# Altium project esp32-s3.PrjPcb
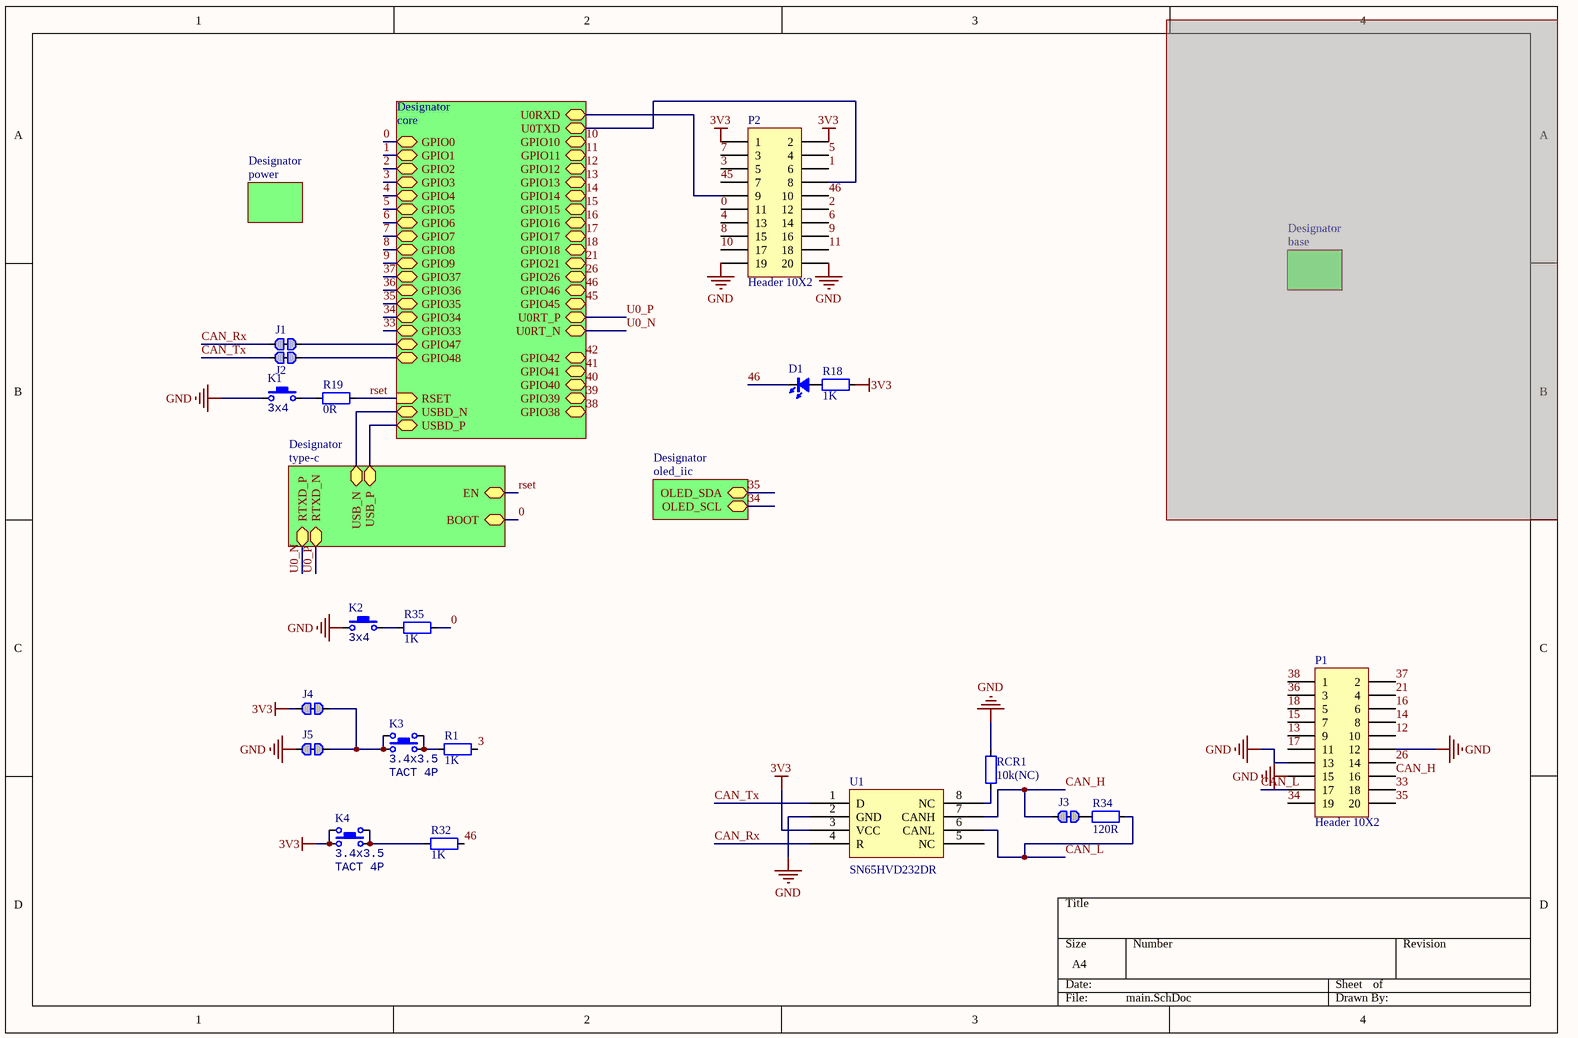
[diagram p0: main.SchDoc]
5 sheets, 70 parts. Net scope: hierarchical (ports join the sheet entries above them; power ports are global).
Board files: esp32-s3.PcbDoc, power.PcbDoc, port.PcbDoc, PCB1.PcbDoc
Sheets:
  main.SchDoc
    Designator = core.SchDoc
    Designator = type-c.SchDoc
    Designator = power.SchDoc

## Sheet main.SchDoc
size A4; SheetNumber: 1; SheetTotal: 6

### Parts
D1  color?  [LED_0402_RED]  (value not drawn)
J1  跳线  [0402-0R]  (value not drawn)
J2  跳线  [0402-0R]  (value not drawn)
J3  跳线  [0402-0R]  (value not drawn)
J4  跳线  [0402-0R]  (value not drawn)
J5  跳线  [0402-0R]  (value not drawn)
K1  value 3x4  [ButtonTACT_3x4x2_180]  (hidden comment: TACT 2P)
K2  value 3x4  [ButtonTACT_3x4x2_180]  (hidden comment: TACT 2P)
K3  value 3.4x3.5  [ButtonTACT_3.5*3.55_90]  (hidden comment: TACT 4P)
K4  value 3.4x3.5  [ButtonTACT_3.5*3.55_90]  (hidden comment: TACT 4P)
P1  Header 10X2  [HEAER_0.8mm_2x10P_M]
P2  Header 10X2  [HEAER_0.8mm_2x10P_M]
R1  1K  [RES_0402]
R18  1K  [RES_0402]
R19  0R  [RES_0402]
R32  1K  [RES_0402]
R34  120R  [RES_0402]
R35  1K  [RES_0402]
RCR1  10k(NC)  [RES_0402]
U1  Manufacturer Part Number: SN65HVD232DR  [SO-8]  (hidden comment: SN65HVD232D)

### Sub-sheets
Designator = core: GPIO1 (bidir), GPIO2 (bidir), GPIO3 (bidir), GPIO4 (bidir), GPIO5 (bidir), GPIO6 (bidir), GPIO7 (bidir), GPIO8 (bidir), GPIO9 (bidir), GPIO37 (bidir), GPIO36 (bidir), GPIO35 (bidir), GPIO34 (bidir), GPIO47 (bidir), GPIO33 (bidir), GPIO48 (bidir), RSET (in), GPIO0 (bidir), GPIO10 (bidir), GPIO11 (bidir), GPIO12 (bidir), GPIO13 (bidir), GPIO14 (bidir), GPIO15 (bidir), GPIO17 (bidir), GPIO16 (bidir), GPIO18 (bidir), GPIO26 (bidir), GPIO21 (bidir), GPIO45 (bidir), U0RT_P (bidir), U0RT_N (bidir), GPIO42 (bidir), GPIO41 (bidir), GPIO40 (bidir), GPIO39 (bidir), GPIO38 (bidir), GPIO46 (bidir), USBD_N (bidir), USBD_P (bidir), U0TXD (bidir), U0RXD (bidir)
Designator = type-c: USB_P (bidir), USB_N (bidir), RTXD_P (bidir), RTXD_N (bidir), EN (bidir), BOOT (bidir)
Designator = power: no entries
Designator = oled_iic (file not in this document): OLED_SDA (bidir), OLED_SCL (bidir)
Designator = base (masked out): no entries

### Nets
3V3: J4.1 K4.1 K4.3 P2.1 P2.2 R18.1 U1.3(VCC)
GND: J5.1 K1.1 K2.1 P1.12 P1.13 P1.15 P2.19 P2.20 RCR1.2 U1.2(GND)
0: P2.11 R35.2 ; sheet Designator/GPIO0, sheet Designator/BOOT
1: P2.6 ; sheet Designator/GPIO1
2: P2.12 ; sheet Designator/GPIO2
3: P2.5 R1.2 ; sheet Designator/GPIO3
4: P2.13 ; sheet Designator/GPIO4
5: P2.4 ; sheet Designator/GPIO5
6: P2.14 ; sheet Designator/GPIO6
7: P2.3 ; sheet Designator/GPIO7
8: P2.15 ; sheet Designator/GPIO8
9: P2.16 ; sheet Designator/GPIO9
10: P2.17 ; sheet Designator/GPIO10
11: P2.18 ; sheet Designator/GPIO11
12: P1.10 ; sheet Designator/GPIO12
13: P1.9 ; sheet Designator/GPIO13
14: P1.8 ; sheet Designator/GPIO14
15: P1.7 ; sheet Designator/GPIO15
16: P1.6 ; sheet Designator/GPIO16
17: P1.11 ; sheet Designator/GPIO17
18: P1.5 ; sheet Designator/GPIO18
21: P1.4 ; sheet Designator/GPIO21
26: P1.14 ; sheet Designator/GPIO26
33: P1.18 ; sheet Designator/GPIO33
34: P1.19 ; sheet Designator/GPIO34, sheet Designator/OLED_SCL
35: P1.20 ; sheet Designator/GPIO35, sheet Designator/OLED_SDA
36: P1.3 ; sheet Designator/GPIO36
37: P1.2 ; sheet Designator/GPIO37
38: P1.1 ; sheet Designator/GPIO38
45: P2.7 ; sheet Designator/GPIO45
46: D1.2(K) P2.10 R32.2 ; sheet Designator/GPIO46
CAN_H: J3.1 P1.16 U1.7(CANH)
CAN_L: P1.17 R34.2 U1.6(CANL)
CAN_Rx: J1.1 U1.4(R)
CAN_Tx: J2.1 U1.1(D)
GPIO47: J1.2 ; sheet Designator/GPIO47
GPIO48: J2.2 ; sheet Designator/GPIO48
rset: R19.2 ; sheet Designator/RSET, sheet Designator/EN  [project net CHIP_CPU]
U0_N: sheet Designator/U0RT_N, sheet Designator/RTXD_P  [project net RTXD_P]
U0_P: sheet Designator/U0RT_P, sheet Designator/RTXD_N  [project net RTXD_N]
U0RT_N: P2.8 ; sheet Designator/U0TXD
U0RT_P: P2.9 ; sheet Designator/U0RXD
USB_N: sheet Designator/USBD_N, sheet Designator/USB_N
USB_P: sheet Designator/USBD_P, sheet Designator/USB_P
NetD1_1: D1.1(A) R18.2
NetJ3_2: J3.2 R34.1
NetJ4_2: J4.2 J5.2 K3.1 K3.3
NetK1_2: K1.2 R19.1
NetK2_2: K2.2 R35.1
NetK3_2: K3.2 K3.4 R1.1
NetK4_2: K4.2 K4.4 R32.1
NetRCR1_1: RCR1.1 U1.8(NC)

Not connected (* = marked no-connect by the designer): U1 5(NC)

### Library data of the parts
D1 = LED_0402: LED; Type: 0402; Value: color?
J1-J5 = 跳线: Resistor; Published: 8-Jun-2000; LatestRevisionDate: 17-Jul-2002; LatestRevisionNote: Re-released for DXP Platform.; PackageReference: AXIAL-0.4; Publisher: Altium Limited; PackageDescription: Axial Device, Thru-Hole; 2 Leads; 0.4 in Pin Spacing
K1 K2 = ButtonTACT_3x4x2_180: Button; type: TACT 2P
K3 K4 = ButtonTACT: Button; type: TACT 4P
P1 P2 = Header 10X2: Header, 10-Pin, Dual row; LatestRevisionDate: 17-Jul-2002; LatestRevisionNote: Re-released for DXP Platform.; Publisher: Altium Limited
R1 R18 R19 R32 R34 R35 RCR1 = 电阻-0402: Resistor; Value: 22R
U1 = SN65HVD232D: Manufacturer: Texas Instruments; Protocol: CAN; Number of Drivers/Receivers: 1/1; Duplex: Half; Data Rate: 1Mbps; Voltage - Supply: 3 V ~ 3.6 V; Supplier 1: Digi-Key; Supplier Part Number 1: 296-26344-2-ND; RoHS: RoHS Compliant; Category: Integrated Circuits (ICs); Stock: 5000; Pricing 1: 2500=0.84375 (USD); Packaging: Tape & Reel (TR); Part Status: Active; Type: Transceiver; Operating Temperature: -40°C ~ 85°C; Mounting Type: Surface Mount; Package / Case: 8-SOIC (0.154", 3.90mm Width); Supplier Device Package: 8-SOIC; ComponentLink1URL: http://www.ti.com/lit/ds/symlink/sn65hvd230.pdf; ComponentLink1Description: http://www.ti.com/lit/ds/symlink/sn65hvd230.pdf; Supplier 2: Digi-Key; Supplier Part Number 2: 296-26344-1-ND; Pricing 2: 1=2.05, 10=1.842, 100=1.4809, 500=1.21668, 1000=1.00811 (USD)

## Sheet core.SchDoc
size A4; SheetNumber: 2; SheetTotal: 6
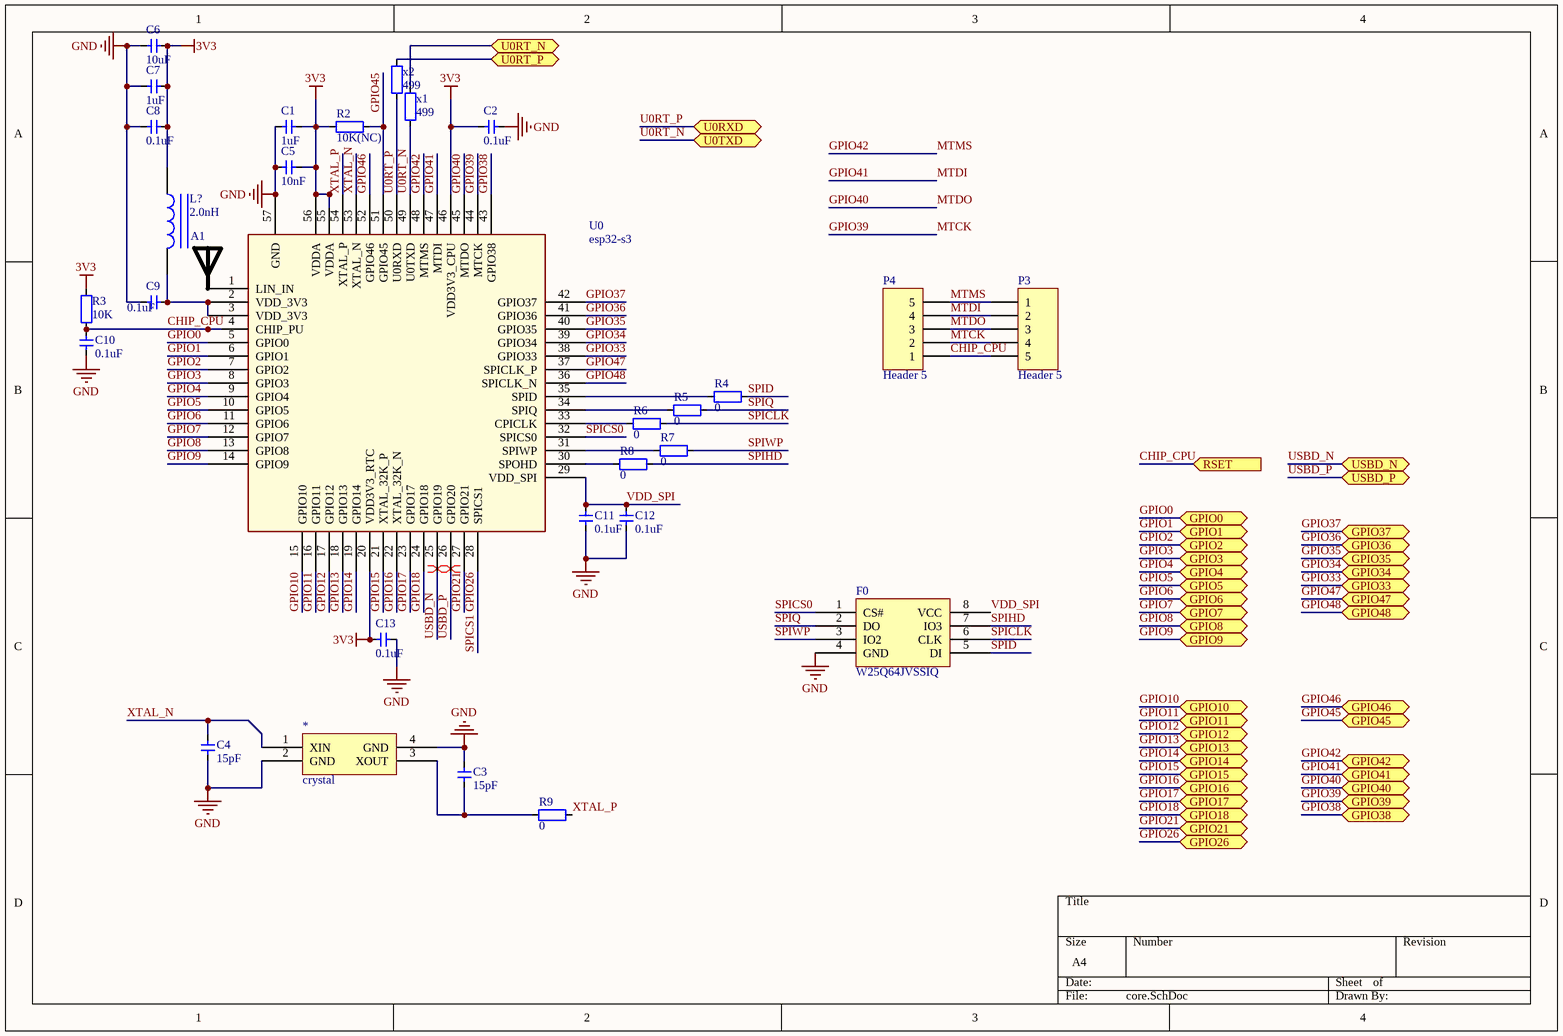
[diagram p1: core.SchDoc]

### Parts
*  crystal  [无源晶振]
A1  RAINSUN  [ANT-Rainsun-AN5120]  (value not drawn)
C1  1uF  [CAP_0402]
C2  0.1uF  [CAP_0402]
C3  15pF  [CAP_0402]
C4  15pF  [CAP_0402]
C5  10nF  [CAP_0402]
C6  10uF  [CAP_0402]
C7  1uF  [CAP_0402]
C8  0.1uF  [CAP_0402]
C9  0.1uF  [CAP_0402]
C10  0.1uF  [CAP_0402]
C11  0.1uF  [CAP_0402]
C12  0.1uF  [CAP_0402]
C13  0.1uF  [CAP_0402]
F0  W25Q64JVSSIQ  [W25Q64JVSSIQ]
L?  2.0nH  [LC-0402_L]
P3  Header 5  [HDR1X5]
P4  Header 5  [HDR1X5]
R2  10K(NC)  [RES_0402]
R3  10K  [RES_0402]
R4  0  [RES_0402]
R5  0  [RES_0402]
R6  0  [RES_0402]
R7  0  [RES_0402]
R8  0  [RES_0402]
R9  0  [RES_0402]
U0  esp32-s3  [esp32-s3]
x1  499  [RES_0402]
x2  499  [RES_0402]

### Ports
GPIO0 (bidir), GPIO1 (bidir), GPIO2 (bidir), GPIO3 (bidir), GPIO4 (bidir), GPIO5 (bidir), GPIO6 (bidir), GPIO7 (bidir), GPIO8 (bidir), GPIO9 (bidir), GPIO10 (bidir), GPIO11 (bidir), GPIO12 (bidir), GPIO13 (bidir), GPIO14 (bidir), GPIO15 (bidir), GPIO16 (bidir), GPIO17 (bidir), GPIO18 (bidir), GPIO21 (bidir), GPIO26 (bidir), GPIO33 (bidir), GPIO34 (bidir), GPIO35 (bidir), GPIO36 (bidir), GPIO37 (bidir), GPIO38 (bidir), GPIO39 (bidir), GPIO40 (bidir), GPIO41 (bidir), GPIO42 (bidir), GPIO45 (bidir), GPIO46 (bidir), GPIO47 (bidir), GPIO48 (bidir), RSET (in), U0RT_N (bidir), U0RT_P (bidir), U0RXD (bidir), U0TXD (bidir), USBD_N (bidir), USBD_P (bidir)

### Nets
3V3: C1.2 C2.2 C5.2 C6.2 C7.2 C8.2 C13.2 L?.1 R2.2 R3.1 U0.20(VDD3V3_RTC) U0.46(VDD3V3_CPU) U0.55(VDDA) U0.56(VDDA)
GND: *.2(GND) *.4(GND) C1.1 C2.1 C3.1 C4.1 C5.1 C6.1 C7.1 C8.1 C9.1 C10.2 C11.1 C12.1 C13.1 F0.4(GND) U0.57(GND)
CHIP_CPU: C10.1 P3.5 P4.1 R3.2 U0.4(CHIP_PU) ; port RSET
GPIO0: U0.5(GPIO0) ; port GPIO0  [project net 0]
GPIO1: U0.6(GPIO1) ; port GPIO1  [project net 1]
GPIO2: U0.7(GPIO2) ; port GPIO2  [project net 2]
GPIO3: U0.8(GPIO3) ; port GPIO3  [project net 3]
GPIO4: U0.9(GPIO4) ; port GPIO4  [project net 4]
GPIO5: U0.10(GPIO5) ; port GPIO5  [project net 5]
GPIO6: U0.11(GPIO6) ; port GPIO6  [project net 6]
GPIO7: U0.12(GPIO7) ; port GPIO7  [project net 7]
GPIO8: U0.13(GPIO8) ; port GPIO8  [project net 8]
GPIO9: U0.14(GPIO9) ; port GPIO9  [project net 9]
GPIO10: U0.15(GPIO10) ; port GPIO10  [project net 10]
GPIO11: U0.16(GPIO11) ; port GPIO11  [project net 11]
GPIO12: U0.17(GPIO12) ; port GPIO12  [project net 12]
GPIO13: U0.18(GPIO13) ; port GPIO13  [project net 13]
GPIO14: U0.19(GPIO14) ; port GPIO14  [project net 14]
GPIO15: U0.21(XTAL_32K_P) ; port GPIO15  [project net 15]
GPIO16: U0.22(XTAL_32K_N) ; port GPIO16  [project net 16]
GPIO17: U0.23(GPIO17) ; port GPIO17  [project net 17]
GPIO18: U0.24(GPIO18) ; port GPIO18  [project net 18]
GPIO21: U0.27(GPIO21) ; port GPIO21  [project net 21]
GPIO26: U0.28(SPICS1) ; port GPIO26  [also labelled SPICS1]  [project net 26]
GPIO33: U0.38(GPIO33) ; port GPIO33  [project net 33]
GPIO34: U0.39(GPIO34) ; port GPIO34  [project net 34]
GPIO35: U0.40(GPIO35) ; port GPIO35  [project net 35]
GPIO36: U0.41(GPIO36) ; port GPIO36  [project net 36]
GPIO37: U0.42(GPIO37) ; port GPIO37  [project net 37]
GPIO38: U0.43(GPIO38) ; port GPIO38  [project net 38]
GPIO39: P3.4 P4.2 U0.44(MTCK) ; port GPIO39  [also labelled MTCK]  [project net 39]
GPIO40: P3.3 P4.3 U0.45(MTDO) ; port GPIO40  [also labelled MTDO]  [project net 40]
GPIO41: P3.2 P4.4 U0.47(MTDI) ; port GPIO41  [also labelled MTDI]  [project net 41]
GPIO42: P3.1 P4.5 U0.48(MTMS) ; port GPIO42  [also labelled MTMS]  [project net 42]
GPIO45: R2.1 U0.51(GPIO45) ; port GPIO45  [project net 45]
GPIO46: U0.52(GPIO46) ; port GPIO46  [project net 46]
GPIO47: U0.37(SPICLK_P) ; port GPIO47
GPIO48: U0.36(SPICLK_N) ; port GPIO48
RTXD_N: x2.1 ; port U0RT_P
RTXD_P: x1.1 ; port U0RT_N
SPICLK: F0.6(CLK) R6.1
SPICS0: F0.1(CS#) U0.32(SPICS0)
SPID: F0.5(DI) R4.1
SPIHD: F0.7(IO3) R8.1
SPIQ: F0.2(DO) R5.1
SPIWP: F0.3(IO2) R7.1
U0RT_N: U0.49(U0TXD) x1.2 ; port U0TXD
U0RT_P: U0.50(U0RXD) x2.2 ; port U0RXD
USBD_N: U0.25(GPIO19) ; port USBD_N  [project net USB_N]
USBD_P: U0.26(GPIO20) ; port USBD_P  [project net USB_P]
VDD_SPI: C11.2 C12.2 F0.8(VCC) U0.29(VDD_SPI)
XTAL_N: *.1(XIN) C4.2 U0.53(XTAL_N)
XTAL_P: R9.1 U0.54(XTAL_P)
Net*_3: *.3(XOUT) C3.2 R9.2
NetA1_1: A1.1 U0.1(LIN_IN)
NetC9_2: C9.2 L?.2 U0.2(VDD_3V3) U0.3(VDD_3V3)
NetR4_2: R4.2 U0.35(SPID)
NetR5_2: R5.2 U0.34(SPIQ)
NetR6_2: R6.2 U0.33(CPICLK)
NetR7_2: R7.2 U0.31(SPIWP)
NetR8_2: R8.2 U0.30(SPOHD)

### Layout directives
differential pair: USB_N, USB_P

### Library data of the parts
A1 = ANT-Rainsun-AP5120
C1-C13 = 电容-0402: Capacitor; Value: 0.1u
L? = 0402 2.7nH 0.3nH: 贴片电感; ComponentLink1Description: 供应商链接; ComponentLink1URL: http://www.szlcsc.com/product/details_27872.html; Package: 0402; Supplier: LC; SuppliersPartNumber: C27123
P3 P4 = Header 5: Header, 5-Pin; LatestRevisionDate: 17-Jul-2002; LatestRevisionNote: Re-released for DXP Platform.; Publisher: Altium Limited
R2-R9 x1 x2 = 电阻-0402: Resistor; Value: 22R

## Sheet type-c.SchDoc
size A4; SheetNumber: 3; SheetTotal: 6
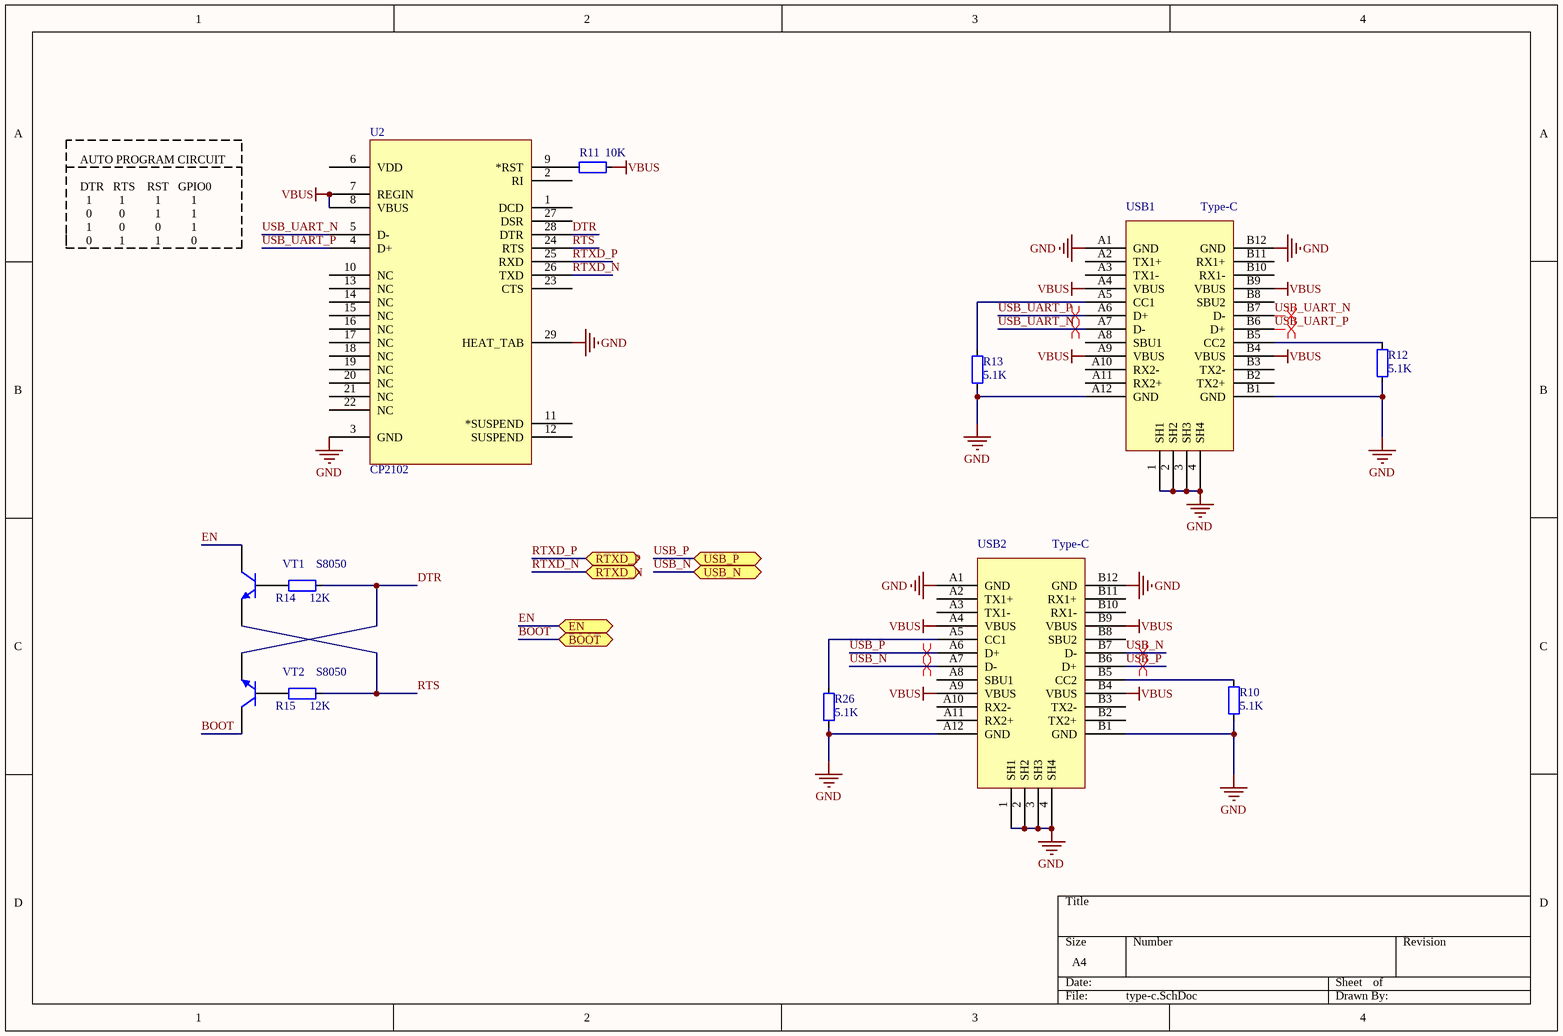
[diagram p2: type-c.SchDoc]

### Parts
R10  5.1K  [RES_0402]
R11  10K  [RES_0402]
R12  5.1K  [RES_0402]
R13  5.1K  [RES_0402]
R14  12K  [RES_0402]
R15  12K  [RES_0402]
R26  5.1K  [RES_0402]
U2  CP2102  [QFN-28]
USB1  Type-C  [Type-C-TOP]
USB2  Type-C  [Type-C-TOP]
VT1  S8050  [SMT_TRIODE_NPN]
VT2  S8050  [SMT_TRIODE_NPN]

### Ports
BOOT (bidir), EN (bidir), RTXD_N (bidir), RTXD_P (bidir), USB_N (bidir), USB_P (bidir)

### Nets
GND: R10.2 R12.2 R13.2 R26.2 U2.3(GND) U2.29(HEAT_TAB) USB1.1(SH1) USB1.2(SH2) USB1.3(SH3) USB1.4(SH4) USB1.A1(GND) USB1.A12(GND) USB1.B1(GND) USB1.B12(GND) USB2.1(SH1) USB2.2(SH2) USB2.3(SH3) USB2.4(SH4) USB2.A1(GND) USB2.A12(GND) USB2.B1(GND) USB2.B12(GND)
VBUS: R11.1 U2.7(REGIN) U2.8(VBUS) USB1.A4(VBUS) USB1.A9(VBUS) USB1.B4(VBUS) USB1.B9(VBUS) USB2.A4(VBUS) USB2.A9(VBUS) USB2.B4(VBUS) USB2.B9(VBUS)
BOOT: VT2.3(C) ; port BOOT  [project net 0]
DTR: R14.1 U2.28(DTR) VT2.2(E)
EN: VT1.3(C) ; port EN  [project net CHIP_CPU]
RTS: R15.1 U2.24(RTS) VT1.2(E)
RTXD_N: U2.26(TXD) ; port RTXD_N
RTXD_P: U2.25(RXD) ; port RTXD_P
USB_N: USB2.A7(D-) USB2.B7(D-) ; port USB_N
USB_P: USB2.A6(D+) USB2.B6(D+) ; port USB_P
USB_UART_N: U2.5(D-) USB1.A7(D-) USB1.B7(D-)
USB_UART_P: U2.4(D+) USB1.A6(D+) USB1.B6(D+)
NetR10_1: R10.1 USB2.B5(CC2)
NetR11_2: R11.2 U2.9(*RST)
NetR12_1: R12.1 USB1.B5(CC2)
NetR13_1: R13.1 USB1.A5(CC1)
NetR14_2: R14.2 VT1.1(B)
NetR15_2: R15.2 VT2.1(B)
NetR26_1: R26.1 USB2.A5(CC1)

Not connected (* = marked no-connect by the designer): U2 1(DCD) 2(RI) 6(VDD) 10(NC) 11(*SUSPEND) 12(SUSPEND) 13(NC) 14(NC) 15(NC) 16(NC) 17(NC) 18(NC) 19(NC) 20(NC) 21(NC) 22(NC) 23(CTS) 27(DSR); USB1 A2(TX1+) A3(TX1-) A8(SBU1) A10(RX2-) A11(RX2+) B2(TX2+) B3(TX2-) B8(SBU2) B10(RX1-) B11(RX1+); USB2 A2(TX1+) A3(TX1-) A8(SBU1) A10(RX2-) A11(RX2+) B2(TX2+) B3(TX2-) B8(SBU2) B10(RX1-) B11(RX1+)

### Layout directives
differential pair: USB_N, USB_P, USB_UART_N, USB_UART_P

### Notes on the sheet
- AUTO PROGRAM CIRCUIT
  DTR   RTS    RST   GPIO0
  1         1          1          1
  0         0          1          1
  1         0          0          1
  0         1          1          0

### Library data of the parts
R10-R15 R26 = 电阻-0402: Resistor; Value: 22R
U2 = CP2102: USB转TTL; PART DESC: SINGLE-CHIP USB TO UART BRIDGE, QFN28, RoHS.; MFG #1: SILICON LABS; PART NUMBER: CP2102; Value: Value; RefDes: RefDes; Type: DEV
USB1 USB2 = USB-Type-C-TOP
VT1 VT2 = SMT_TRIODE_NPN: Surface mount NPN transistor, package SOT-23

## Sheet power.SchDoc
size A4; SheetNumber: 4; SheetTotal: 6
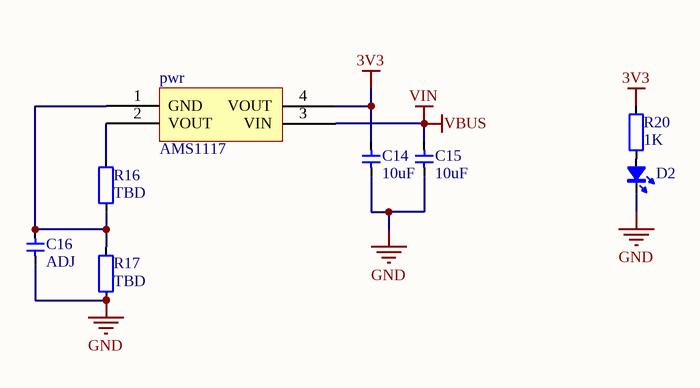
[diagram p3: power.SchDoc]

### Parts
C14  10uF  [C0603]
C15  10uF  [C0603]
C16  ADJ  [C0603]
D2  color?  [LED_0402_RED]  (value not drawn)
pwr  AMS1117  [SOT223_L]
R16  TBD  [R0603]
R17  TBD  [R0603]
R20  1K  [RES_0402]

### Nets
3V3: C14.2 pwr.4(VOUT) R20.1
GND: C14.1 C15.1 C16.1 D2.2(K) R17.2
VBUS: C15.2 pwr.3(VIN)  [also labelled VIN]
NetC16_2: C16.2 pwr.1(GND) R16.2 R17.1
NetD2_1: D2.1(A) R20.2
Netpwr_2: pwr.2(VOUT) R16.1

### Library data of the parts
C14-C16 = 电容-0402: Capacitor; Value: 0.1u
D2 = LED_0402: LED; Type: 0402; Value: color?
R16 R17 R20 = 电阻-0402: Resistor; Value: 22R

## Nets that join several sheets
3V3: main (7 pins), core (14 pins), power (C14.2 pwr.4 R20.1)
GND: main (10 pins), core (17 pins), type-c (22 pins), power (5 pins)
VBUS: type-c (11 pins), power (C15.2 pwr.3)
0: main (P2.11 R35.2), core (U0.5), type-c (VT2.3)
1: main (P2.6), core (U0.6)
2: main (P2.12), core (U0.7)
3: main (P2.5 R1.2), core (U0.8)
4: main (P2.13), core (U0.9)
5: main (P2.4), core (U0.10)
6: main (P2.14), core (U0.11)
7: main (P2.3), core (U0.12)
8: main (P2.15), core (U0.13)
9: main (P2.16), core (U0.14)
10: main (P2.17), core (U0.15)
11: main (P2.18), core (U0.16)
12: main (P1.10), core (U0.17)
13: main (P1.9), core (U0.18)
14: main (P1.8), core (U0.19)
15: main (P1.7), core (U0.21)
16: main (P1.6), core (U0.22)
17: main (P1.11), core (U0.23)
18: main (P1.5), core (U0.24)
21: main (P1.4), core (U0.27)
26: main (P1.14), core (U0.28)
33: main (P1.18), core (U0.38)
34: main (P1.19), core (U0.39)
35: main (P1.20), core (U0.40)
36: main (P1.3), core (U0.41)
37: main (P1.2), core (U0.42)
38: main (P1.1), core (U0.43)
45: main (P2.7), core (R2.1 U0.51)
46: main (D1.2 P2.10 R32.2), core (U0.52)
CHIP_CPU: main (R19.2), core (5 pins), type-c (VT1.3)
GPIO47: main (J1.2), core (U0.37)
GPIO48: main (J2.2), core (U0.36)
RTXD_N: core (x2.1), type-c (U2.26)
RTXD_P: core (x1.1), type-c (U2.25)
U0RT_N: main (P2.8), core (U0.49 x1.2)
U0RT_P: main (P2.9), core (U0.50 x2.2)
USB_N: core (U0.25), type-c (USB2.A7 USB2.B7)
USB_P: core (U0.26), type-c (USB2.A6 USB2.B6)